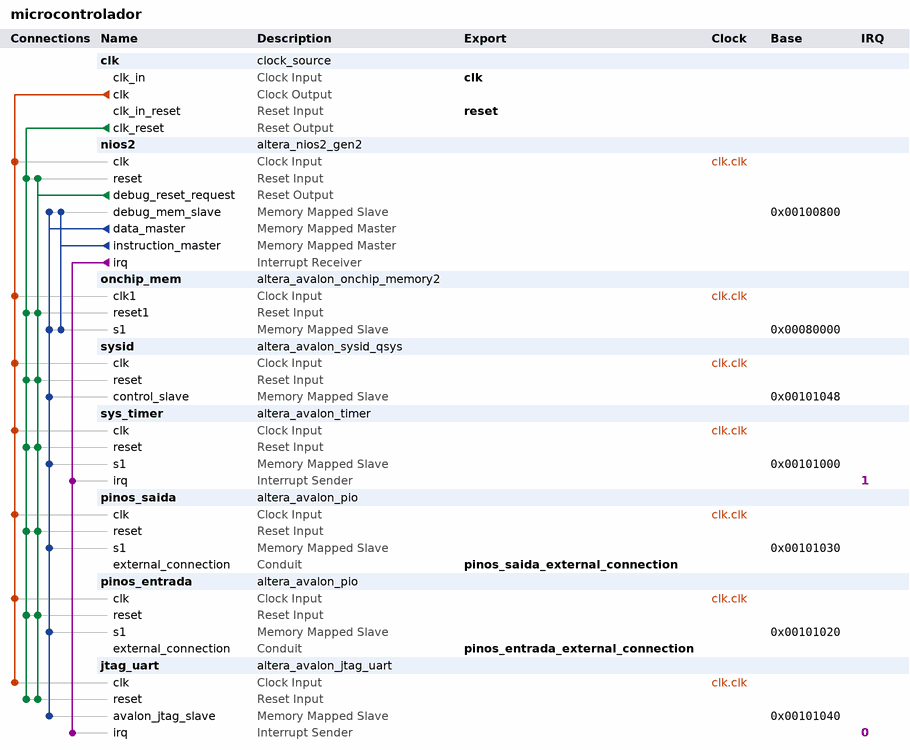
[diagram p0: system contents]
# Platform Designer (Qsys) system microcontrolador, Cyclone IV E EP4CE115F29C7
# Parameters at their usual value, and those the tool derives, are not listed.
package require -exact qsys 20.1
create_system microcontrolador
set_project_property DEVICE_FAMILY {Cyclone IV E}
set_project_property DEVICE EP4CE115F29C7

add_instance clk clock_source 20.1
set_instance_parameter_value clk clockFrequency 50000000

add_instance nios2 altera_nios2_gen2 20.1
set_instance_parameter_value nios2 dcache_size 2048
set_instance_parameter_value nios2 exceptionSlave onchip_mem.s1
set_instance_parameter_value nios2 icache_size 4096
set_instance_parameter_value nios2 impl Tiny
set_instance_parameter_value nios2 resetSlave onchip_mem.s1

add_instance onchip_mem altera_avalon_onchip_memory2 20.1
set_instance_parameter_value onchip_mem dataWidth 32
set_instance_parameter_value onchip_mem dualPort false
set_instance_parameter_value onchip_mem initMemContent true
set_instance_parameter_value onchip_mem initializationFileName onchip_mem.hex
set_instance_parameter_value onchip_mem memorySize 400000

add_instance sysid altera_avalon_sysid_qsys 20.1
set_instance_parameter_value sysid id 10

add_instance sys_timer altera_avalon_timer 20.1
set_instance_parameter_value sys_timer period 1
set_instance_parameter_value sys_timer periodUnits MSEC

add_instance pinos_saida altera_avalon_pio 20.1
set_instance_parameter_value pinos_saida direction Output
set_instance_parameter_value pinos_saida width 8

add_instance pinos_entrada altera_avalon_pio 20.1
set_instance_parameter_value pinos_entrada direction Input
set_instance_parameter_value pinos_entrada width 8

add_instance jtag_uart altera_avalon_jtag_uart 20.1
set_instance_parameter_value jtag_uart simInteractiveOptions NO_INTERACTIVE_WINDOWS

# connections
add_connection clk.clk jtag_uart.clk clock
add_connection clk.clk nios2.clk clock
add_connection clk.clk onchip_mem.clk1 clock
add_connection clk.clk pinos_entrada.clk clock
add_connection clk.clk pinos_saida.clk clock
add_connection clk.clk sys_timer.clk clock
add_connection clk.clk sysid.clk clock
add_connection clk.clk_reset jtag_uart.reset reset
add_connection clk.clk_reset nios2.reset reset
add_connection clk.clk_reset onchip_mem.reset1 reset
add_connection clk.clk_reset pinos_entrada.reset reset
add_connection clk.clk_reset pinos_saida.reset reset
add_connection clk.clk_reset sys_timer.reset reset
add_connection clk.clk_reset sysid.reset reset
add_connection nios2.debug_reset_request jtag_uart.reset reset
add_connection nios2.debug_reset_request nios2.reset reset
add_connection nios2.debug_reset_request onchip_mem.reset1 reset
add_connection nios2.debug_reset_request pinos_entrada.reset reset
add_connection nios2.debug_reset_request pinos_saida.reset reset
add_connection nios2.debug_reset_request sys_timer.reset reset
add_connection nios2.debug_reset_request sysid.reset reset
add_connection nios2.data_master jtag_uart.avalon_jtag_slave avalon
set_connection_parameter_value nios2.data_master/jtag_uart.avalon_jtag_slave baseAddress 0x00101040
add_connection nios2.data_master nios2.debug_mem_slave avalon
set_connection_parameter_value nios2.data_master/nios2.debug_mem_slave baseAddress 0x00100800
add_connection nios2.data_master onchip_mem.s1 avalon
set_connection_parameter_value nios2.data_master/onchip_mem.s1 baseAddress 0x00080000
add_connection nios2.data_master pinos_entrada.s1 avalon
set_connection_parameter_value nios2.data_master/pinos_entrada.s1 baseAddress 0x00101020
add_connection nios2.data_master pinos_saida.s1 avalon
set_connection_parameter_value nios2.data_master/pinos_saida.s1 baseAddress 0x00101030
add_connection nios2.data_master sys_timer.s1 avalon
set_connection_parameter_value nios2.data_master/sys_timer.s1 baseAddress 0x00101000
add_connection nios2.data_master sysid.control_slave avalon
set_connection_parameter_value nios2.data_master/sysid.control_slave baseAddress 0x00101048
add_connection nios2.instruction_master nios2.debug_mem_slave avalon
set_connection_parameter_value nios2.instruction_master/nios2.debug_mem_slave baseAddress 0x00100800
add_connection nios2.instruction_master onchip_mem.s1 avalon
set_connection_parameter_value nios2.instruction_master/onchip_mem.s1 baseAddress 0x00080000
add_connection nios2.irq jtag_uart.irq interrupt
set_connection_parameter_value nios2.irq/jtag_uart.irq irqNumber 0
add_connection nios2.irq sys_timer.irq interrupt
set_connection_parameter_value nios2.irq/sys_timer.irq irqNumber 1

# exported interfaces
add_interface clk clock sink
set_interface_property clk EXPORT_OF clk.clk_in
add_interface pinos_entrada_external_connection conduit end
set_interface_property pinos_entrada_external_connection EXPORT_OF pinos_entrada.external_connection
add_interface pinos_saida_external_connection conduit end
set_interface_property pinos_saida_external_connection EXPORT_OF pinos_saida.external_connection
add_interface reset reset sink
set_interface_property reset EXPORT_OF clk.clk_in_reset

set_interconnect_requirement {$system} qsys_mm.clockCrossingAdapter HANDSHAKE
set_interconnect_requirement {$system} qsys_mm.enableEccProtection FALSE
set_interconnect_requirement {$system} qsys_mm.insertDefaultSlave FALSE
set_interconnect_requirement {$system} qsys_mm.maxAdditionalLatency 1

save_system microcontrolador.qsys
